# EAGLE design untitled (EAGLE 9.6.2)
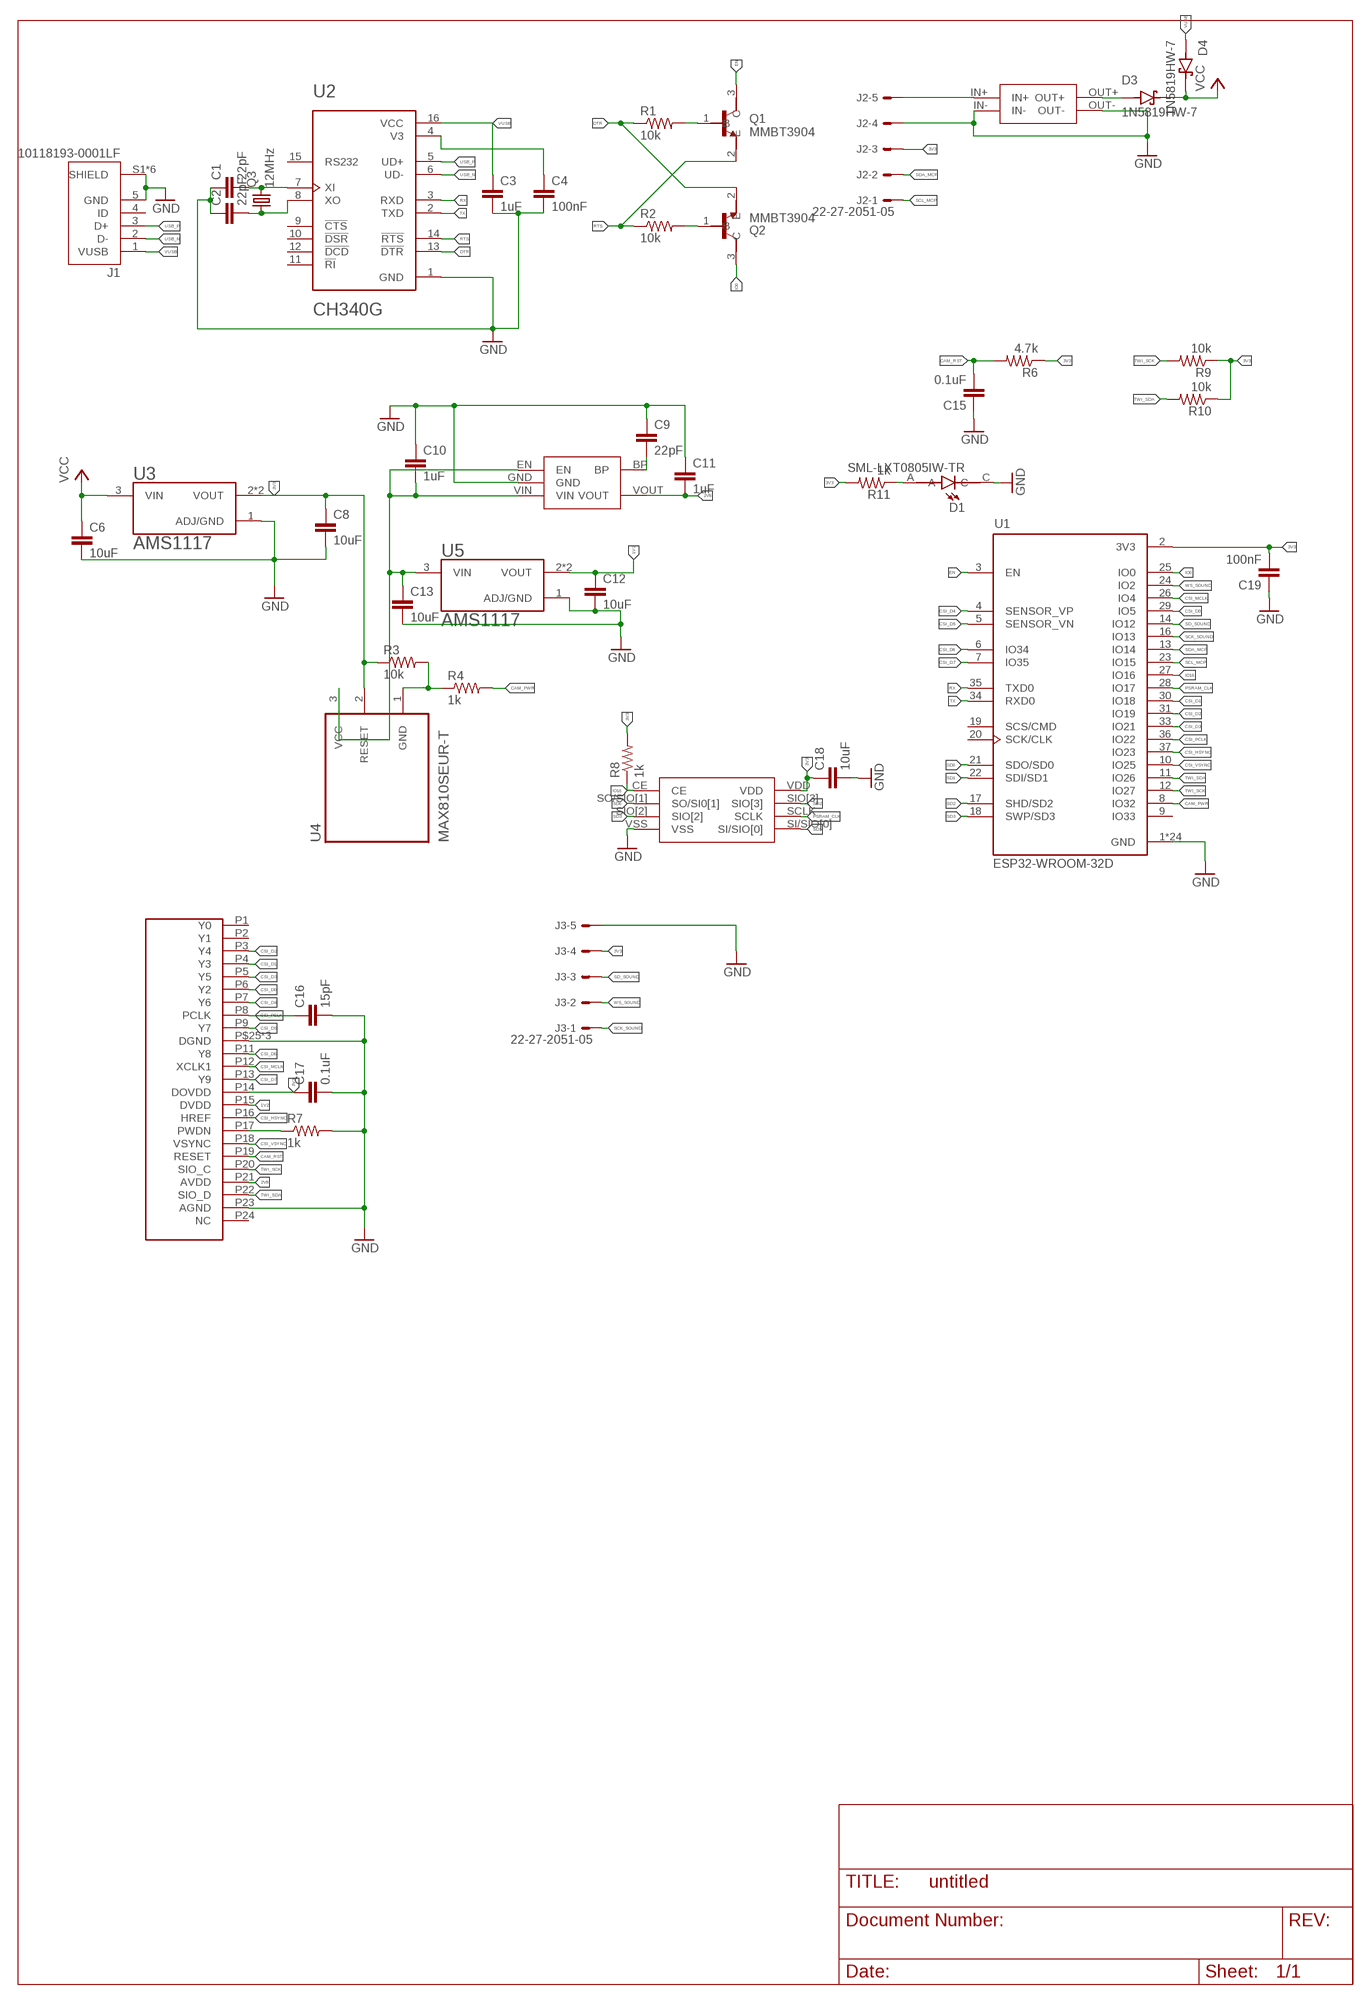
[diagram p0: schematic, sheet 1]

## Parts
APS6404L1  APS6404L  [APS6404L]
C1  22pF  C-EUC0805K  [C0805K]
C2  22pF  C-EUC0805K  [C0805K]
C3  1uF  C-EUC0805K  [C0805K]
C4  100nF  C-EUC0805K  [C0805K]
C6  10uF  C-EUC0805K  [C0805K]
C8  10uF  C-EUC0805K  [C0805K]
C9  22pF  C-EUC0805K  [C0805K]
C10  1uF  C-EUC0805K  [C0805K]
C11  1uF  C-EUC0805K  [C0805K]
C12  10uF  C-EUC0805K  [C0805K]
C13  10uF  C-EUC0805K  [C0805K]
C15  0.1uF  C-EUC0805K  [C0805K]
C16  15pF  C-EUC0805K  [C0805K]
C17  0.1uF  C-EUC0805K  [C0805K]
C18  10uF  C-EUC0805K  [C0805K]
C19  100nF  C-EUC0805K  [C0805K]
CAM1  OV2640  [FPC-24]
D1  SML-LXT0805IW-TR  [LEDC2012X120N]
D3  1N5819HW-7  [SOD3715X145N]
D4  1N5819HW-7  [SOD3715X145N]
J1  10118193-0001LF  [FCI_10118193-0001LF]
J2  22-27-2051-05  [6410-05]
J3  22-27-2051-05  [6410-05]
MINI1  MINI560  [MINI560]
Q1  MMBT3904  [SOT95P240X120-3N]
Q2  MMBT3904  [SOT95P240X120-3N]
Q3  12MHz  CRYSTALSM49  [SM49]
R1  10k  R-US_M0805  [M0805]
R2  10k  R-US_M0805  [M0805]
R3  10k  R-US_M0805  [M0805]
R4  1k  R-US_M0805  [M0805]
R6  4.7k  R-US_M0805  [M0805]
R7  1k  R-US_M0805  [M0805]
R8  1k  R-US_M0805  [M0805]
R9  10k  R-US_M0805  [M0805]
R10  10k  R-US_M0805  [M0805]
R11  1k  R-US_M0805  [M0805]
RT9193-28GB1  RT9193-28GB  [SOT94P279X129-5N]
U1  ESP32-WROOM-32D  [MODULE_ESP32-WROOM-32D]
U2  CH340G  [SOIC127P600X180-16N]
U3  AMS1117  [SOT229P700X180-4N]
U4  MAX810SEUR-T  [SOT95P237X112-3N]
U5  AMS1117  [SOT229P700X180-4N]

## Nets
1V2: C12.1 CAM1.P15(DVDD) U5.2(VOUT) U5.4(VOUT)
2V8: C11.2 CAM1.P21(AVDD) RT9193-28GB1.VOUT
3V3: APS6404L1.VDD C8.1 C17.1 C18.1 C19.2 CAM1.P14(DOVDD) J2.3 J3.4 R3.1 R6.1 R8.2 R9.1 R10.1 R11.2 U1.2(3V3) U3.2(VOUT) U3.4(VOUT) U4.2(RESET)
CAM_PWR: R4.2 U1.8(IO32)
CAM_RST: C15.2 CAM1.P19(RESET) R6.2
CSI_D0: CAM1.P6(Y2) U1.29(IO5)
CSI_D1: CAM1.P4(Y3) U1.30(IO18)
CSI_D2: CAM1.P3(Y4) U1.31(IO19)
CSI_D3: CAM1.P5(Y5) U1.33(IO21)
CSI_D4: CAM1.P7(Y6) U1.4(SENSOR_VP)
CSI_D5: CAM1.P9(Y7) U1.5(SENSOR_VN)
CSI_D6: CAM1.P11(Y8) U1.6(IO34)
CSI_D7: CAM1.P13(Y9) U1.7(IO35)
CSI_HSYNC: CAM1.P16(HREF) U1.37(IO23)
CSI_MCLK: CAM1.P12(XCLK1) U1.26(IO4)
CSI_PCLK: C16.1 CAM1.P8(PCLK) U1.36(IO22)
CSI_VSYNC: CAM1.P18(VSYNC) U1.10(IO25)
DTR: Q2.2(E) R1.1 U2.13(!DTR)
EN: Q1.3(C) U1.3(EN)
GND: APS6404L1.VSS C1.1 C2.1 C3.2 C4.2 C6.2 C8.2 C9.1 C10.1 C11.1 C12.2 C13.2 C15.1 C16.2 C17.2 C18.2 C19.1 CAM1.P10(DGND) CAM1.P23(AGND) CAM1.P$25(DGND) CAM1.P$26(DGND) D1.C J1.5(GND) J1.S1(SHIELD) J1.S2(SHIELD) J1.S3(SHIELD) J1.S4(SHIELD) J1.S5(SHIELD) J1.S6(SHIELD) J2.4 J3.5 MINI1.IN- MINI1.OUT- R7.2 RT9193-28GB1.GND U1.1(GND) U1.15(GND) U1.38(GND) U1.39_1(GND) U1.39_2(GND) U1.39_3(GND) U1.39_4(GND) U1.39_5(GND) U1.39_6(GND) U1.39_7(GND) U1.39_8(GND) U1.39_9(GND) U1.39_10(GND) U1.39_11(GND) U1.39_12(GND) U1.39_13(GND) U1.39_14(GND) U1.39_15(GND) U1.39_16(GND) U1.39_17(GND) U1.39_18(GND) U1.39_19(GND) U1.39_20(GND) U1.39_21(GND) U2.1(GND) U3.1(ADJ/GND) U5.1(ADJ/GND)
IO0: Q2.3(C) U1.25(IO0)
IO16: APS6404L1.CE R8.1 U1.27(IO16)
N$2: C1.2 Q3.2 U2.7(XI)
N$3: C2.2 Q3.1 U2.8(XO)
N$4: Q1.1(B) R1.2
N$5: R3.2 R4.1 U4.1(GND)
N$6: D1.A R11.1
N$7: J2.5 MINI1.IN+
N$8: C10.2 C13.1 RT9193-28GB1.EN RT9193-28GB1.VIN U4.3(VCC) U5.3(VIN)
N$9: C4.1 U2.4(V3)
N$10: Q2.1(B) R2.2
N$11: C9.2 RT9193-28GB1.BP
N$14: D3.A MINI1.OUT+
N$24: CAM1.P17(PWDN) R7.1
PSRAM_CLK: APS6404L1.SCLK U1.28(IO17)
RTS: Q1.2(E) R2.1 U2.14(!RTS)
RX: U1.35(TXD0) U2.3(RXD)
SCK_SOUND: J3.1 U1.16(IO13)
SCL_MCP: J2.1 U1.23(IO15)
SD0: APS6404L1.SO/SIO[1](SO/SI0[1]) U1.21(SDO/SD0)
SD1: APS6404L1.SI/SIO[0] U1.22(SDI/SD1)
SD2: APS6404L1.SIO[3] U1.17(SHD/SD2)
SD3: APS6404L1.SIO[2] U1.18(SWP/SD3)
SD_SOUND: J3.3 U1.14(IO12)
SDA_MCP: J2.2 U1.13(IO14)
TWI_SCK: CAM1.P20(SIO_C) R9.2 U1.12(IO27)
TWI_SDA: CAM1.P22(SIO_D) R10.2 U1.11(IO26)
TX: U1.34(RXD0) U2.2(TXD)
USB_N: J1.2(D-) U2.6(UD-)
USB_P: J1.3(D+) U2.5(UD+)
VCC: C6.1 D3.C(K) D4.C(K) U3.3(VIN)
VUSB: C3.1 D4.A J1.1(VUSB) U2.16(VCC)
WS_SOUND: J3.2 U1.24(IO2)
Unconnected: CAM1.P1(Y0) CAM1.P2(Y1) CAM1.P24(NC) J1.4(ID) U1.9(IO33) U1.19(SCS/CMD) U1.20(SCK/CLK) U2.9(!CTS) U2.10(!DSR) U2.11(!RI) U2.12(!DCD) U2.15(RS232)

## Library data of the parts
APS6404L1 = APS6404L:APS6404L
C1-C4 C6 C8-C13 C15-C19 = rcl:C-EU: CAPACITOR, European symbol; SPICEPREFIX: C
CAM1 = OV2640:OV2640: OV2640 connector, 24 pin FPC. LCSC C283126 Check availability <https://pricing.snapeda.com/parts/OV2640/Omnivision%20Technologies/view-part?ref=eda>; AVAILABILITY: Not in stock; DESCRIPTION: OV2640 Camera Sensor M5Stack Platform Evaluation Expansion Board; MF: Omnivision Technologies; MP: OV2640; PACKAGE: None; PRICE: None
D1 = SML-LXT0805IW-TR:SML-LXT0805IW-TR: LED; Luminous Intensity:11µcd; Viewing Angle:140°; Forward Current:30mA; Forward Voltage:2V; Color:Red; LED Color:Red; Leaded Process Compatible:Yes; Lens Color:White; Mounting Type:Surface Mount ;RoHS Compliant: Yes Check availability <https://pricing.snapeda.com/parts/SML-LXT0805IW-TR/Lumex%20Opto/Components/view-part?ref=eda>; AVAILABILITY: In Stock; DESCRIPTION: Red - LED Indication - Discrete 2V 0805 (2012 Metric); MF: Lumex Opto/Components; MP: SML-LXT0805IW-TR; PACKAGE: 0805 Lumex; PRICE: None; PURCHASE-URL: https://pricing.snapeda.com/search/part/SML-LXT0805IW-TR/?ref=eda
D3 D4 = 1N5819HW-7:1N5819HW-7: 1N5819HW Series 40 V 1 A Surface Mount Schottky Barrier Rectifier - SOD-123 Check availability <https://pricing.snapeda.com/parts/1N5819HW-7/Diodes%20Inc./view-part?ref=eda>; AVAILABILITY: In Stock; DESCRIPTION: Diode Schottky 40 V 1A Surface Mount SOD-123; MF: Diodes Inc.; MP: 1N5819HW-7; PACKAGE: SOD-123 Fairchild Semiconductor; PRICE: None; PURCHASE-URL: https://pricing.snapeda.com/search/part/1N5819HW-7/?ref=eda
J1 = 10118193-0001LF:10118193-0001LF: Micro USB B Type Receptacle Check availability <https://pricing.snapeda.com/parts/10118193-0001LF/FCI/view-part?ref=eda>; AVAILABILITY: In Stock; DESCRIPTION: USB - micro B USB 2.0 Receptacle Connector 5 Position Surface Mount, Right Angle; Through Hole; MF: FCI; MP: 10118193-0001LF; PACKAGE: None; PRICE: None; PURCHASE-URL: https://pricing.snapeda.com/search/part/10118193-0001LF/?ref=eda
J2 J3 = con-molex:22-?-05: CONNECTOR wire to board 2.54 mm (.1 inch) pitch header; MF: MOLEX; OC_FARNELL: unknown; OC_NEWARK: unknown
MINI1 = MINI560:MINI560
Q1 Q2 = MMBT3904:MMBT3904: MMBT3904 Series 40 V CE Breakdown 0.2 A NPN General Purpose Amplifier - SOT-23 Check availability <https://pricing.snapeda.com/parts/MMBT3904/ON%20Semiconductor/view-part?ref=eda>; AVAILABILITY: In Stock; DESCRIPTION: Bipolar (BJT) Transistor NPN 40 V 200 mA 300MHz 300 mW Surface Mount SOT-23-3 (TO-236); MF: ON Semiconductor; MP: MMBT3904; PACKAGE: SOT-23-3 Motorola; PRICE: None
Q3 = crystal:CRYSTAL: CRYSTAL; OC_FARNELL: unknown; OC_NEWARK: unknown
R1-R4 R6-R11 = rcl:R-US_: RESISTOR, American symbol; SPICEPREFIX: R
RT9193-28GB1 = RT9193-28GB:RT9193-28GB
U1 = ESP32-WROOM-32D:ESP32-WROOM-32D: Bluetooth, WiFi 802.11b/g/n, Bluetooth v4.2 + EDR, Class 1, 2 and 3 Transceiver Module 2.4GHz ~ 2.5GHz Integrated, Trace Surface Mount Check availability <https://pricing.snapeda.com/parts/ESP32-WROOM-32D/Espressif%20Systems/view-part?ref=eda>; AVAILABILITY: In Stock; DESCRIPTION: Bluetooth, WiFi 802.11b/g/n, Bluetooth v4.2 +EDR, Class 1, 2 and 3 Transceiver Module 2.4GHz ~ 2.5GHz Integrated; MF: Espressif Systems; MP: ESP32-WROOM-32D; PACKAGE: Module Espressif Systems; PRICE: None; PURCHASE-URL: https://pricing.snapeda.com/search/part/ESP32-WROOM-32D/?ref=eda
U2 = CH340G:CH340G: Check availability <https://pricing.snapeda.com/parts/Ch340G/WCH/view-part?ref=eda>; AVAILABILITY: Not in stock; DESCRIPTION: USB Interface Integrated Circuit; MF: WCH; MP: Ch340G; PACKAGE: None; PRICE: None
U3 U5 = AMS1117:AMS1117: Sot223/Pkg 1-Amp 5-Volt Low Drop Out Voltage Regulatator Check availability <https://pricing.snapeda.com/parts/AMS1117/Advanced%20Monolithic%20Systems/view-part?ref=eda>; AVAILABILITY: Not in stock; DESCRIPTION: 1A LOW DROPOUT VOLTAGE REGULATOR SOT-223; MF: Advanced Monolithic Systems; MP: AMS1117; PACKAGE: SOT-223 Seeed Technology; PRICE: None
U4 = MAX810SEUR-T:MAX810SEUR-T: Check availability <https://pricing.snapeda.com/parts/MAX810SEUR%2BT/Analog%20Devices/view-part?ref=eda>; AVAILABILITY: In Stock; DESCRIPTION: 3-Pin Microprocessor Reset Circuits; MF: Analog Devices; MP: MAX810SEUR+T; PACKAGE: SOT-23-3 Maxim Integrated; PRICE: None; PURCHASE-URL: https://pricing.snapeda.com/search/part/MAX810SEUR+T/?ref=eda

## Board
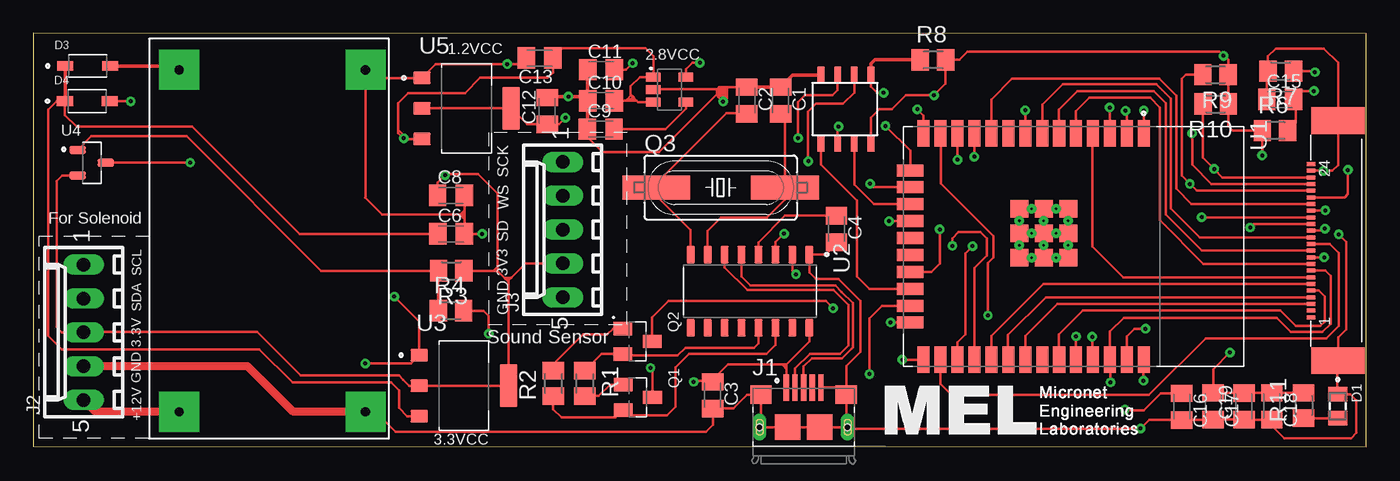
[diagram p1: board, top side]
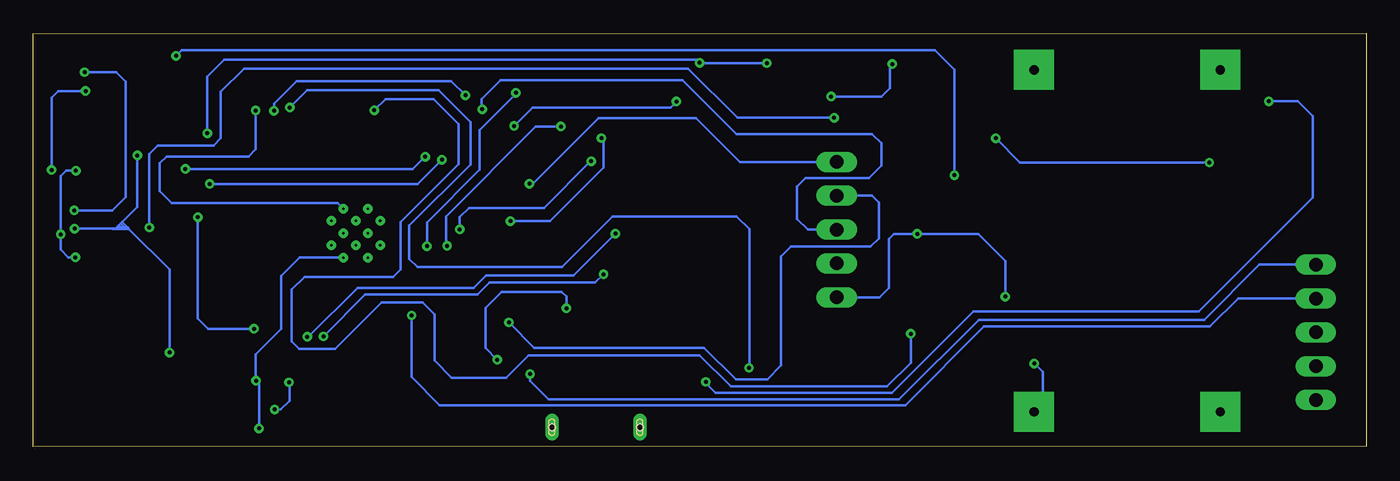
[diagram p2: board, bottom side, seen from below]

Size 99.97 x 31.03 mm. Coordinates in mm from the lower left corner, seen from the top.
Outline: 0,0.03 99.97,0 99.97,31 0,31.03 0,0.03
Copper layers (1*16): Top 0.035mm / dielectric 1.5mm / Bottom 0.035mm
Design rules "default *": minimum track width 6mil, minimum drill 0.3mm, track to track 6mil, track to pad 6mil, pad to pad 6mil, via to via 6mil, smd to smd 6mil, copper to edge 40mil, drill to drill 6mil, minimum pad ring 10mil, minimum via ring 8mil, stop-mask expansion 4mil, vias tented up to drill 0mil, thermal gap 10mil

### Footprints (pad centres in the part's own frame; a part is rotated, then mirrored left to right if it is on the bottom)
APS6404L = smd 1.27 x 0.5: CE -2.4,2.2; SCLK 2.7,-0.3; SI/SIO[0] 2.7,-1.55; SIO[2] -2.4,-0.3; SIO[3] 2.7,0.95; SO/SIO[1] -2.4,0.95; VDD 2.7,2.2; VSS -2.4,-1.55
C0805K = smd 1.3 x 1.6: 1 -1,0; 2 1,0
FPC-24 = smd 0.3 x 0.65: P1 5.75,0; P2 5.25,0; P3 4.75,0; P4 4.25,0; P5 3.75,0; P6 3.25,0; P7 2.75,0; P8 2.25,0; P9 1.75,0; P10 1.25,0; P11 0.75,0; P12 0.25,0; P13 -0.25,0; P14 -0.75,0; P15 -1.25,0; P16 -1.75,0; P17 -2.25,0; P18 -2.75,0; P19 -3.25,0; P20 -3.75,0; P21 -4.25,0; P22 -4.75,0; P23 -5.25,0; P24 -5.75,0 | smd 2 x 4: P$25 9,2.04; P$26 -9,2.04
LEDC2012X120N = smd 1.1 x 1.45: A 0.9,0; C -0.9,0
SOD3715X145N = smd 1.21 x 0.73: A 1.68,0; C -1.68,0
FCI_10118193-0001LF = smd 0.4 x 2: 1 -1.3,2.975; 2 -0.65,2.975; 3 0,2.975; 4 0.65,2.975; 5 1.3,2.975 | smd 1.6 x 1.4: S1 -3.2,2.45; S2 3.2,2.45 | smd 1.9 x 1.9: S3 1.2,0; S4 -1.2,0 | drill 0.5 pad 0.9 long: S5 -3.3,0; S6 3.3,0 | hole 0.5: -3.3,0; 3.3,0
6410-05 = drill 1.016 long: 1 5.08,0; 2 2.54,0; 3 0,0; 4 -2.54,0; 5 -5.08,0
MINI560 = drill 0.7 pad 3 square: IN+ 0,-1.27; IN- 0,-15.24; OUT+ 25.67,-1.27; OUT- 25.67,-15.24
SOT95P240X120-3N = smd 1 x 1.4: 1 -0.95,-1.1; 2 0.95,-1.1; 3 0,1.1
SM49 = smd 5.08 x 1.778: 1 -4.826,0; 2 4.826,0
M0805 = smd 1.3 x 1.6: 1 -0.95,0; 2 0.95,0
SOT94P279X129-5N = smd 1.17 x 0.67: BP 1.22,-0.94; EN -1.22,-0.94; GND -1.22,0; VIN -1.22,0.94; VOUT 1.22,0.94
MODULE_ESP32-WROOM-32D = smd 2 x 0.9: 1 -8.5,5.26; 2 -8.5,3.99; 3 -8.5,2.72; 4 -8.5,1.45; 5 -8.5,0.18; 6 -8.5,-1.09; 7 -8.5,-2.36; 8 -8.5,-3.63; 9 -8.5,-4.9; 10 -8.5,-6.17; 11 -8.5,-7.44; 12 -8.5,-8.71; 13 -8.5,-9.98; 14 -8.5,-11.25; 25 8.5,-11.25; 26 8.5,-9.98; 27 8.5,-8.71; 28 8.5,-7.44; 29 8.5,-6.17; 30 8.5,-4.9; 31 8.5,-3.63; 32 8.5,-2.36; 33 8.5,-1.09; 34 8.5,0.18; 35 8.5,1.45; 36 8.5,2.72; 37 8.5,3.99; 38 8.5,5.26 | smd 0.9 x 2: 15 -5.715,-12.25; 16 -4.445,-12.25; 17 -3.175,-12.25; 18 -1.905,-12.25; 19 -0.635,-12.25; 20 0.635,-12.25; 21 1.905,-12.25; 22 3.175,-12.25; 23 4.445,-12.25; 24 5.715,-12.25 | smd 1.33 x 1.33: 39_1 -2.835,-0.405; 39_2 -1,-0.405; 39_3 0.835,-0.405; 39_4 -2.835,-2.24; 39_5 -1,-2.24; 39_6 0.835,-2.24; 39_7 -2.835,-4.075; 39_8 -1,-4.075; 39_9 0.835,-4.075 | drill 0.2 pad 0.3: 39_10 -1.917,-0.405; 39_11 -0.083,-0.405; 39_12 -2.835,-1.323; 39_13 -1,-1.323; 39_14 0.835,-1.323; 39_15 -1.917,-2.24; 39_16 -0.083,-2.24; 39_17 -2.835,-3.158; 39_18 -1,-3.158; 39_19 0.835,-3.158; 39_20 -1.917,-4.075; 39_21 -0.083,-4.075
SOIC127P600X180-16N = smd 1.31 x 0.62: 1 -2.75,4.445; 2 -2.75,3.175; 3 -2.75,1.905; 4 -2.75,0.635; 5 -2.75,-0.635; 6 -2.75,-1.905; 7 -2.75,-3.175; 8 -2.75,-4.445; 9 2.75,-4.445; 10 2.75,-3.175; 11 2.75,-1.905; 12 2.75,-0.635; 13 2.75,0.635; 14 2.75,1.905; 15 2.75,3.175; 16 2.75,4.445
SOT229P700X180-4N = smd 1.31 x 0.93: 1 -3.345,2.29; 2 -3.345,0; 3 -3.345,-2.29 | smd 1.31 x 3.24: 4 3.345,0
SOT95P237X112-3N = smd 1.23 x 0.59: 1 -1.06,0.95; 2 -1.06,-0.95; 3 1.06,0

### Placement (x,y rotation side)
APS6404L1  60.63,25.5 270 top
C1  56.05,25.99 270 top
C2  53.51,25.99 270 top
C3  50.96,3.87 270 top
C4  60.23,16.35 270 top
C6  31.33,15.98 0 top
C8  31.32,18.87 0 top
C9  42.56,23.84 0 top
C10  42.58,25.97 0 top
C11  42.58,28.3 0 top
C12  38.55,25.2 90 top
C13  37.97,29.17 180 top
C15  93.51,26.06 0 top
C16  86.14,3 270 top
C17  88.49,3.04 270 top
C18  92.9,3.05 270 top
C19  90.81,3.03 90 top
CAM1  95.83,15.47 270 top
D1  97.84,3.04 270 top
D3  4.09,28.58 0 top
D4  4.06,25.94 0 top
J1  57.78,1.47 0 top
J2  3.78,8.59 90 top
J3  39.7,16.3 90 top
MINI1  9.67,2.62 90 top
Q1  45.35,3.71 270 top
Q2  45.31,7.91 270 top
Q3  51.55,19.46 0 top
R1  41.37,4.76 270 top
R2  39,4.75 90 top
R3  31.35,13.2 180 top
R4  31.32,10.21 0 top
R6  93.13,23.73 0 top
R7  93.56,28.19 180 top
R8  67.48,29.03 0 top
R9  88.67,27.92 180 top
R10  88.68,25.73 180 top
R11  95.28,3.09 90 top
RT9193-28GB1  47.73,26.8 0 top
U1  78.03,15.03 270 top
U2  53.75,11.67 270 top
U3  32.29,4.58 0 top
U4  4.39,21.32 0 top
U5  32.49,25.4 0 top

### Tracks (layer width: path | path; a pad name or v marks a point on that pad's centre or on a via)
1V2  (via drill 0.3)
  Top 0.2: CAM1.P15 91.53,16.72 v91.26,16.46 | v39.91,24.68 39.43,24.2 C12.1
  Top 0.203: U5.2 U5.4 37.03,24.2 C12.1
  Bottom 0.2: v91.26,16.46 91.26,21.97 90.62,22.61 86.46,22.61 85.9,23.16 85.9,26.64 84.15,28.39 50.86,28.39 47.15,24.68 v39.91,24.68
2V8  (via drill 0.3)
  Top 0.2: CAM1.P21 88.36,19.72 86.92,21.16 v86.92,23.53 | v49.99,28.81 49.43,28.81 48.95,28.33 RT9193-28GB1.VOUT | C11.2 44.47,28.3 v44.95,28.79
  Bottom 0.2: v86.92,23.53 86.92,27.78 85.66,29.04 50.22,29.04 v49.99,28.81 49.96,28.79 v44.95,28.79
3V3  (via drill 0.3)
  Top 0.2: CAM1.P14 96.73,16.22 v96.87,16.36 | v92.16,21.86 92.16,23.71 R6.1 89.96,23.73 89.61,24.07 89.61,25.72 R10.1 R9.1 89.62,29.03 89.31,29.34 v89.26,29.34 88.97,29.64 70.05,29.64 69.44,29.03 R8.2 68.43,27.25 v67.56,26.38 | C8.1 30.32,19.81 v30.89,20.38 30.96,20.45 33.38,20.45 34.82,19.01 34.82,13.53 | 34.82,13.53 34.82,13.21 34.83,13.2 | v67.55,26.37 v67.56,26.38 | U1.2 82.02,25.12 v81.92,25.22 | 16.79,8.6 20.04,5.36 27.42,5.36 27.74,5.04 | APS6404L1.VDD 62.83,24.7 63.46,25.33 64.4,25.33 65.45,26.38 v67.56,26.38 | C17.1 88.49,5.8 v89.75,7.07 | 34.82,13.53 34.49,13.2 | 35.35,12.68 35.84,12.68 35.86,12.7
  Top 0.203: C17.1 90.8,4.04 C19.2 92.88,4.03 C18.1 R11.2 | U4.2 2.17,20.37 1.74,19.93 1.74,8.98 2.13,8.59 J2.3 3.79,8.6 16.79,8.6 | 27.74,5.04 28.19,4.58 U3.2 U3.4 35.64,12.39 35.6,12.44 | R3.1 34.49,13.2 34.83,13.2 35.35,12.68 35.6,12.44 | J3.4 36.92,13.76 35.86,12.7 35.6,12.44
  Bottom 0.152: 94.06,16.36 94.04,16.34 92.8,16.34
  Bottom 0.2: v96.87,16.36 94.06,16.36 93.8,16.36 93.67,16.49 | 93.67,16.49 93.56,16.61 | 93.56,16.61 93.42,16.74 | 93.42,16.74 93.31,16.85 | 93.31,16.85 92.16,18 v92.16,21.86 | v81.92,25.22 81.92,25.77 80.23,27.45 68.63,27.45 v67.55,26.38 v67.55,26.37 | v30.89,20.38 30.89,28.32 32.34,29.77 88.83,29.77 v89.26,29.34 | v89.26,29.34 | v89.75,7.07 89.75,13.3 92.8,16.34 | 92.8,16.34 | 92.8,16.34 92.89,16.44 | 92.89,16.44 93.31,16.85 | 93.42,16.74 93.12,16.44 | 93.12,16.44 92.89,16.44 | 93.56,16.61 93.39,16.44 | 93.12,16.44 93.39,16.44 | 93.39,16.44 93.62,16.44 93.67,16.49
CAM_PWR  (via drill 0.3)
  Top 0.2: R4.2 33.76,10.21 34.16,9.8 v34.16,8.48 | v74.4,25.25 U1.8
  Bottom 0.2: v34.16,8.48 34.16,6.3 35.94,4.52 47.65,4.52 50.01,6.87 62.81,6.87 64.51,5.17 68.59,5.17 69.89,6.47 69.89,9.94 70.76,10.82 73.84,10.82 77.33,7.33 80.02,7.33 80.59,7.91 80.59,11.79 79.64,12.74 72.97,12.74 72.42,13.29 72.42,16.87 68.07,21.22 68.07,24.23 69.93,26.09 73.55,26.09 v74.4,25.25
CAM_RST  (via drill 0.3)
  Top 0.2: CAM1.P19 98.35,18.72 98.6,18.97 v98.6,20.78 | v96.05,26.69 95.15,26.69 C15.2 | R6.2 94.68,24.32 94.68,26.69
  Bottom 0.2: v98.6,20.78 98.6,26.2 98.11,26.69 v96.05,26.69
CSI_D0
  Top 0.2: CAM1.P6 75.76,12.22 71.86,8.31 U1.29
CSI_D1
  Top 0.2: CAM1.P4 75.94,11.22 73.1,8.38 73.1,6.56 U1.30
CSI_D2
  Top 0.2: CAM1.P3 76.81,10.72 74.4,8.31 U1.31
CSI_D3
  Top 0.2: CAM1.P5 96.42,11.72 96.86,11.28 96.86,9.38 96.54,9.07 94.71,9.07 93.53,10.24 78.71,10.24 76.9,8.44 76.9,6.57 U1.33
CSI_D4
  Top 0.2: CAM1.P7 81.76,12.72 79.44,15.05 79.44,23.49 U1.4
CSI_D5
  Top 0.2: CAM1.P9 87.77,13.72 84.49,17 84.49,25.47 83.78,26.18 79.19,26.18 78.21,25.2 U1.5
CSI_D6
  Top 0.2: CAM1.P11 87.64,14.72 84.94,17.42 84.94,25.8 84.04,26.71 78.32,26.71 76.93,25.31 76.93,23.54 U1.6
CSI_D7
  Top 0.2: CAM1.P13 87.49,15.72 85.33,17.88 85.33,26.11 84.22,27.22 77.21,27.22 75.67,25.68 U1.7
CSI_HSYNC  (via drill 0.3)
  Top 0.2: CAM1.P16 v87.64,17.22 | U1.37 82.02,8.28 82.6,8.86 v83.41,8.86
  Bottom 0.2: v87.64,17.22 87.64,9.64 86.85,8.86 v83.41,8.86
CSI_MCLK
  Top 0.2: CAM1.P12 97.23,15.22 97.91,14.53 97.91,9.08 96.98,8.14 87.93,8.14 83.69,3.9 68.85,3.9 68.04,4.72 68.04,6.52 U1.26
CSI_PCLK  (via drill 0.3)
  Top 0.2: CAM1.P8 96.9,13.22 97.3,12.82 97.3,9.22 96.69,8.61 94.32,8.61 93.26,9.67 81.78,9.67 80.75,8.64 U1.36 80.79,6.49 v80.79,4.83 | C16.1 84.55,4 83.29,2.74 81.92,2.74 v81.87,2.79
  Bottom 0.2: v81.87,2.79 81.41,2.79 80.75,3.46 80.75,4.79 v80.79,4.83
CSI_VSYNC
  Top 0.2: CAM1.P18 86.87,18.22 85.73,19.36 85.73,26.35 84.45,27.63 73.41,27.63 71.84,26.06 71.84,23.55 U1.10
DTR
  Top 0.2: R1.1 42.62,6.96 Q2.2 44.32,6.85 48.32,6.85 48.9,7.43 54.07,7.43 54.39,7.75 U2.13
EN  (via drill 0.3)
  Top 0.2: Q1.3 46.45,5.76 v46.29,5.92 | v80.73,25.46 80.75,25.44 U1.3
  Bottom 0.2: v46.29,5.92 46.27,5.94 46.27,16.33 47.23,17.29 56.51,17.29 60.32,13.48 71.16,13.48 71.79,14.11 71.79,16.59 67.19,21.19 67.19,24.36 69.59,26.76 79.43,26.76 v80.73,25.46
GND  (via drill 0.3)
  Top 0.2: CAM1.P10 v96.81,14.22 v96.82,14.21 | v96.78,20.72 | v96.78,20.72 CAM1.P23 | v96.78,20.72 97.44,20.72 97.86,21.15 CAM1.P$26 97.86,28.81 96.8,29.88 93.18,29.88 92.61,29.31 R7.2 92.51,28.09 C15.1 | CAM1.P$25 97.86,6.79 97.86,8.2 98.47,8.81 98.47,15.36 97.9,15.93 v97.91,15.93 | 32.33,17.42 32.09,17.42 | 32.09,17.42 32,17.42 | 31.98,17.42 26.17,17.42 24.87,18.72 24.91,18.76 MINI1.OUT- 25.52,27.68 | C4.2 60.23,15.19 59.47,14.42 U2.1 58.2,13.09 58.7,12.59 60.39,12.59 62.03,10.96 62.03,7.13 60.98,6.08 J1.S2 | 54.58,3.91 54.58,1.57 J1.S5 J1.S4 J1.S3 J1.S6 | 54.58,3.91 J1.S1 | J1.S6 60.98,1.57 J1.S2 | J1.5 60.45,4.44 J1.S2 | 54.58,3.91 53.54,3.91 52.51,2.87 C3.2 50.97,2.86 50.97,1.64 50.47,1.14 27.91,1.14 27.17,1.14 25.69,2.62 MINI1.IN- | C16.2 83.71,2 83.04,1.34 | J1.S6 61.2,1.34 | J1.S6 61.21,1.34 83.04,1.34 | C18.2 92.9,1.57 93.82,0.65 98.85,0.65 99.24,1.04 99.24,3.47 98.77,3.94 D1.C | v24.9,6.24 24.92,6.26 28.34,6.26 U3.1 28.95,9.39 v27.07,11.28 | U5.1 30.17,28.7 | C6.2 v33.67,15.98 v33.68,15.97 | U1.1 v83.29,25.24 | v83.29,25.24 | 83.04,1.34 v83.04,1.37 | v83.04,1.37 | v83.27,4.96 83.27,6.51 U1.38 | C2.1 52.01,26.99 | 52.01,26.99 51.81,26.99 | 51.64,26.82 51.81,26.99 | RT9193-28GB1.GND 46.53,26.82 51.27,26.82 | 51.64,26.82 51.4,26.82 | 51.4,26.82 51.27,26.82 | C9.1 41.56,23.22 42.68,22.1 46.92,22.1 51.4,26.59 | 51.64,26.82 51.4,26.59 | U1.15 65.78,22.21 v63.91,24.08 | 51.74,26.44 51.74,26.72 | 51.64,26.82 51.74,26.72 | 51.74,26.72 | 51.74,26.72 51.86,26.84 | 51.86,26.84 52.01,26.99 | 51.81,26.99 51.57,26.99 | 51.4,26.82 51.57,26.99 | 51.4,26.82 51.4,26.59 | v51.74,25.91 51.4,26.25 | 51.4,26.38 51.4,26.59 | 51.4,26.25 51.4,26.38
  Top 0.2: 51.4,26.38 51.74,26.72 | 51.4,26.25 51.51,26.35 | 51.51,26.35 51.6,26.44 51.74,26.44 | v51.74,25.91 51.74,26.15 | 51.74,26.15 51.74,26.44 | 51.51,26.35 51.54,26.35 51.74,26.15 | v51.74,25.91 52.01,26.18 52.01,26.54 | 52.01,26.54 52.01,26.99 | 51.74,26.72 51.93,26.54 52.01,26.54 | 51.86,26.84 51.86,26.27 51.74,26.15 | 32.33,17.18 32.09,17.42 | 32.09,17.42 32.33,17.66 32.33,17.72 | 32.33,17.07 31.98,17.42 | 31.98,17.42 32,17.42 | 32,17.42 32.33,17.75 | 51.57,26.99 51.44,26.99 51.27,26.82 | 51.27,26.82 51.27,26.38 51.4,26.25
  Top 0.203: C16.2 88.45,2 C17.2 90.8,2.04 C19.1 92.88,2.03 C18.2 | D1.C 97.81,3.98 97.81,6.74 97.86,6.79 | U5.1 25.52,27.68 | 30.17,28.7 35.52,28.7 v35.54,28.72 36.52,28.72 C13.2 | C6.2 32.33,17.07 32.33,17.18 32.33,17.42 32.33,17.72 32.33,17.75 32.33,18.86 C8.2
  Top 0.254: C11.1 C10.1 | C10.1 41.26,26.29 v40.14,26.29 38.63,26.29 C12.2 | C9.1 41.56,25.94 C10.1 | C2.1 C1.1 | C1.1 | APS6404L1.VSS 56.95,27.9 C1.1
  Top 0.406: 73.98,17.86 U1.39_17 U1.39_4 75.81,17.86 | 73.98,17.86 U1.39_7 | 75.81,17.86 U1.39_12 77.57,17.86 | 77.57,17.86 U1.39_1 | 77.57,17.86 77.57,17 U1.39_10 U1.39_2 | 75.81,17.86 75.79,17.84 U1.39_15 U1.39_5 | 73.98,17.86 73.95,17.84 U1.39_20 73.95,16.06 | 73.95,16.06 U1.39_8 | 74.03,16.03 U1.39_18 U1.39_5 | 74.03,16.03 73.99,16.03 73.95,16.06 | 75.8,16.03 U1.39_13 U1.39_2 | 75.8,16.03 U1.39_5 | 75.8,16.03 75.79,16.02 U1.39_16 75.79,14.24 | U1.39_2 U1.39_11 U1.39_3 U1.39_14 75.83,14.19 75.79,14.24 | 74.03,16.03 73.95,15.96 U1.39_21 U1.39_9 U1.39_19 74.92,14.24 75.79,14.24 | 75.79,14.24 U1.39_6
  Top 0.61: MINI1.IN- 19.49,2.62 16.07,6.05 J2.4
  Bottom 0.2: v96.82,14.21 97.34,14.21 97.91,14.79 v97.91,15.93 97.91,20.3 97.49,20.73 v96.79,20.73 v96.78,20.72 | v24.9,6.24 24.26,5.6 24.26,3.27 MINI1.IN- | J3.5 39.69,11.2 36.51,11.2 35.79,11.92 35.79,15.59 35.4,15.97 v33.68,15.97 33.68,15.96 29.1,15.96 27.07,13.93 v27.07,11.28 | v83.29,25.24 83.29,22.33 83.83,21.79 89.98,21.79 90.49,21.28 90.49,19.21 89.58,18.3 77.14,18.3 U1.39_12 | v83.04,1.37 83.04,4.73 v83.28,4.96 | v83.28,4.96 | v83.28,4.96 v83.27,4.96 83.28,4.97 83.28,6.92 81.37,8.84 81.37,12.82 79.99,14.19 U1.39_14 | v35.54,28.72 35.73,28.72 35.73,26.93 36.37,26.29 v40.14,26.29 | v63.91,24.08 62.52,25.47 52.17,25.47 51.74,25.9 v51.74,25.91
IO0  (via drill 0.3)
  Top 0.2: Q2.3 46.41,9.7 47.65,10.94 59.45,10.94 v59.98,10.4 | U1.25 v65.18,6.53
  Bottom 0.2: v59.98,10.4 59.98,11.26 60.35,11.63 64.85,11.63 66.06,10.42 66.06,7.4 v65.18,6.53
IO16  (via drill 0.3)
  Top 0.2: U1.27 69.32,7.84 69.91,8.42 69.91,14.52 v70.44,15.06 | v63.77,26.56 63.29,26.56 62.83,27.02 APS6404L1.CE
  Top 0.254: R8.1 63.13,29.03 62.83,28.73 APS6404L1.CE
  Bottom 0.2: v70.44,15.06 70.44,16.85 66.5,20.78 66.5,23.78 63.77,26.52 v63.77,26.56
N$2
  Top 0.2: C1.2 56.37,24.66 Q3.2 56.37,18.54 55.04,17.21 51.58,17.21 50.58,16.2 U2.7
N$3
  Top 0.2: C2.2 53.47,25.03 51.99,25.03 46.72,19.77 Q3.1 46.72,18.85 49.31,16.26 U2.8
N$4
  Top 0.2: R1.2 42.41,3.81 43.26,4.65 Q1.1
N$5
  Top 0.2: R3.2 21.6,13.2 11.5,23.3 4.36,23.3 U4.1
  Top 0.203: R4.1 30.37,13.17 R3.2
N$6
  Top 0.203: R11.1 D1.A | D1.A
N$7
  Top 0.61: MINI1.IN+ 4.66,2.62 J2.5
N$8  (via drill 0.3)
  Top 0.2: 45.37,25.86 RT9193-28GB1.EN | 44.84,26.39 44.81,26.42 44.81,27.04 45.5,27.74 RT9193-28GB1.VIN 46.51,29.3 45.91,29.9 39.7,29.9 C13.1 38.97,28.07 38.58,27.68 33.52,27.68 32.37,26.54 28.12,26.54 27.38,25.8 27.38,23.81 | 45.37,25.86 45.07,26.16 | 45.07,26.16 44.96,26.27 | 44.96,26.27 44.84,26.39 | U5.3 28.08,23.11 | 28.03,23.15 27.78,23.4 | 27.78,23.4 27.38,23.81 | 44.84,26.39 44.52,26.07 | 44.52,26.07 44.42,25.97 | C10.2 44.42,25.97 | U4.3 11.75,21.32 v11.76,21.33 | v27.78,23.15 28.03,23.15 | 28.03,23.15 28.08,23.11 | 44.42,25.97 44.89,25.97 | 44.89,25.97 45.26,25.97 45.37,25.86 | 44.52,26.07 44.76,26.07 44.96,26.27 | 44.89,25.97 44.89,25.98 45.07,26.16 | v27.78,23.15 27.78,23.4 | v27.78,23.15 27.83,23.11 28.08,23.11 | 27.38,23.81 27.38,23.56 v27.78,23.15
  Bottom 0.2: v11.76,21.33 25.96,21.33 v27.78,23.15
N$9
  Top 0.2: C4.1 56.39,17.35 54.39,15.35 U2.4
N$10
  Top 0.2: R2.2 39,6.18 41.24,8.42 43.04,8.42 43.48,8.86 Q2.1
N$11
  Top 0.2: C9.2 47.43,23.83 48.96,25.37 48.96,25.85 RT9193-28GB1.BP
N$14
  Top 0.254: MINI1.OUT+ 10.66,28.58 D3.A
N$24  (via drill 0.3)
  Top 0.2: CAM1.P17 96.64,17.72 96.89,17.72 v96.9,17.73 | v96.13,28.11 96.05,28.19 R7.1
  Bottom 0.2: v96.9,17.73 94.07,17.73 93.06,18.74 93.06,27.4 93.77,28.11 v96.13,28.11
PSRAM_CLK  (via drill 0.3)
  Top 0.2: U1.28 70.59,13.4 71.53,14.34 71.53,15.62 71.04,16.1 69.4,16.1 68.94,15.65 v68.94,15.08 | v60.39,24.04 60.33,23.98 APS6404L1.SCLK
  Bottom 0.2: v68.94,15.08 69.03,15.17 69.03,17.3 62.31,24.01 60.42,24.01 v60.39,24.04
RTS
  Top 0.2: R2.1 39,2.82 39.63,2.19 43.68,2.19 Q1.2 44.65,2.35 47.53,2.35 48.16,2.99 48.16,5.95 49.18,6.97 54.99,6.97 55.66,7.64 U2.14
RX  (via drill 0.3)
  Top 0.2: U2.3 55.66,15.35 v56.31,16 | v79.42,8.25 79.42,6.59 U1.35
  Bottom 0.2: v79.42,8.25 79.35,8.25 75.66,11.93 66.95,11.93 66.03,12.86 59.45,12.86 v56.31,16
SCK_SOUND  (via drill 0.3)
  Top 0.2: U1.16 63.03,19.47 v62.76,19.75
  Bottom 0.2: v62.76,19.75 62.5,19.75 57.58,24.67 50.27,24.67 46.97,21.38 J3.1
SCL_MCP  (via drill 0.3)
  Top 0.2: U1.23 63.66,10.58 62.71,9.64 v62.71,5.45
  Bottom 0.2: J2.1 8,13.67 12.14,9.53 29.06,9.53 35.03,3.56 61.34,3.56 62.71,4.93 v62.71,5.45
SD0  (via drill 0.3)
  Top 0.2: APS6404L1.SO/SIO[1] 61.58,26.59 60.73,25.74 58.7,25.74 58.12,25.16 58.12,21.44 v58.12,21.43 | 65.81,13.09 U1.21 67.37,13.12 67.99,13.75 v67.99,16.32
  Bottom 0.2: v58.12,21.43 58.17,21.43 61.67,17.93 67.3,17.93 67.99,17.24 v67.99,16.32
SD1
  Top 0.2: U1.22 62.7,11.85 61.77,12.79 61.77,18.48 59.07,21.18 APS6404L1.SI/SIO[0]
SD2
  Top 0.2: U1.17 63.05,18.2 61.58,19.68 APS6404L1.SIO[3]
SD3  (via drill 0.3)
  Top 0.2: APS6404L1.SIO[2] 60.33,26.77 59.95,26.39 57.87,26.39 57.35,25.87 57.35,23.18 v57.37,23.17 | v64.19,16.93 U1.18
  Bottom 0.2: v57.37,23.17 57.19,22.99 57.19,20.96 61.22,16.93 v64.19,16.93
SD_SOUND  (via drill 0.3)
  Top 0.2: v66.31,25.33 66.78,24.86 U1.14
  Bottom 0.2: J3.3 41.87,16.3 42.68,17.11 42.68,19.54 42.07,20.15 37.31,20.15 36.36,21.09 36.36,22.78 37.05,23.47 47.23,23.47 51.28,27.52 64.91,27.52 66.36,26.07 66.36,25.33 v66.31,25.33
SDA_MCP  (via drill 0.3)
  Top 0.2: U1.13 68.08,23.5 68.06,23.49 68.06,19.75 72.01,15.8 72.01,14.22 71.6,13.81 v71.6,9.85
  Bottom 0.2: J2.2 9.6,11.13 11.71,9.01 28.69,9.01 34.57,3.12 69.49,3.12 71.6,5.23 v71.6,9.85
TWI_SCK  (via drill 0.3)
  Top 0.2: CAM1.P20 87.26,19.22 v86.74,19.73 86.14,20.33 86.14,27.62 86.45,27.92 R9.2 | v69.32,21.55 U1.12
  Bottom 0.2: v86.74,19.73 71.13,19.73 v69.32,21.55
TWI_SDA  (via drill 0.3)
  Top 0.2: CAM1.P22 89.19,20.22 v88.57,20.84 87.73,21.69 R10.2 | v70.57,21.77 70.57,23.51 U1.11
  Bottom 0.2: v88.57,20.84 71.52,20.84 70.6,21.77 v70.57,21.77
TX  (via drill 0.3)
  Top 0.2: U2.2 56.93,13.22 v57.2,12.95 | v78.21,8.28 U1.34
  Bottom 0.2: v57.2,12.95 57.82,12.33 65.75,12.33 66.66,11.42 75.07,11.42 v78.21,8.28
USB_N
  Top 0.2: J1.2 57.13,5.86 58.25,6.98 60.5,6.98 61.13,7.61 61.13,10.63 60.01,11.75 53.56,11.75 51.85,13.46 U2.6
USB_P
  Top 0.2: J1.3 57.78,6.02 58.39,6.63 60.65,6.63 61.38,7.36 | 61.38,7.36 | 61.38,7.36 61.48,7.46 61.48,10.78 60.62,11.63 60.15,12.1 53.8,12.1 53.12,12.78 U2.5
VCC
  Top 0.2: C6.1 19.97,15.98 11.93,24.02 3.24,24.02 2.36,24.9 2.36,25.93 D4.C | 16.3,7.3 16.95,7.3 19.44,4.82 26.84,4.82 27.43,4.23
  Top 0.203: U3.3 28.05,2.29 27.43,2.91 27.43,4.23 | 16.3,7.3 2.12,7.3 1.12,8.31 1.12,25.32 1.74,25.94 D4.C
  Top 0.254: D4.C 2.37,28.55 D3.C
VUSB  (via drill 0.3)
  Top 0.2: J1.1 56.48,5.92 | 56.48,5.92 56.48,6.19 | U2.16 58.2,7.91 56.48,6.19 | D4.A v7.29,25.94 v7.3,25.93 | C3.1 50.96,4.93 | 50.96,4.93 50.96,5.4 | v49.53,4.87 49.59,4.93 50.86,4.93 | 50.86,4.93 50.96,4.93 | 56.48,6.19 56.24,6.19 | 56.24,6.19 56.15,6.19 | 56.15,6.19 52.12,6.19 50.86,4.93 | 56.48,5.92 56.24,6.16 56.24,6.19 | 56.48,5.92 56.41,5.92 56.15,6.19
  Bottom 0.2: v7.3,25.93 5.13,25.93 4.01,24.82 4.01,18.7 12.54,10.17 29.46,10.17 35.59,4.04 48.81,4.04 49.53,4.76 v49.53,4.87
WS_SOUND  (via drill 0.3)
  Top 0.2: v64.29,9.33 65.76,9.33 U1.24
  Bottom 0.2: J3.2 37.06,18.84 36.55,18.33 36.55,15.63 37.17,15.01 43.15,15.01 43.89,14.27 43.89,6.09 44.92,5.06 47.28,5.06 49.65,7.44 62.4,7.44 v64.29,9.33

### Text on the board
tNames: 1.2VCC | 2.8VCC | SCK | WS | For Solenoid | SD | SCL | 3V3 | SDA | GND | Sound Sensor | 3.3V | GND | +12V | 3.3VCC